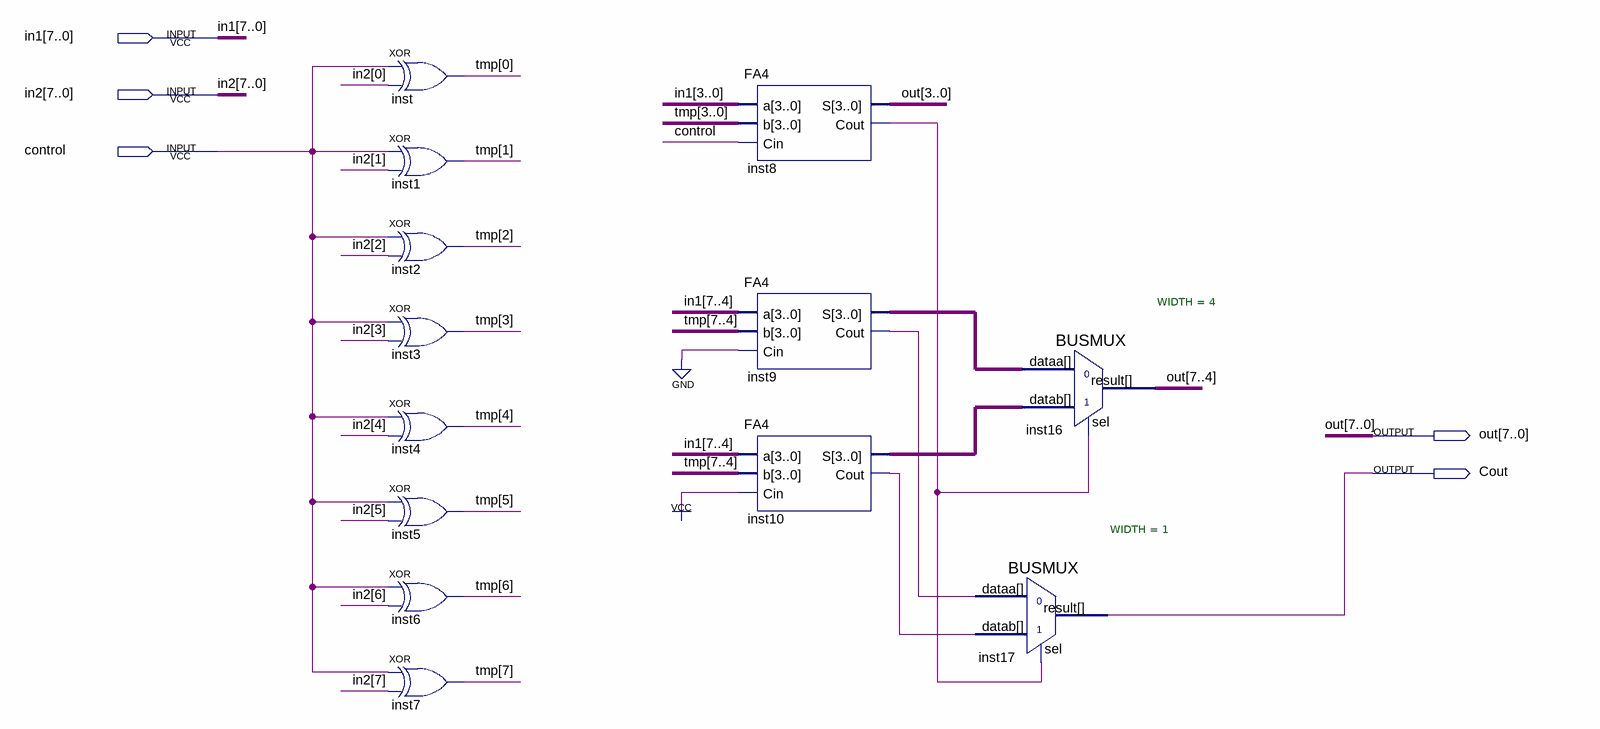
[diagram p0: schematic sheet]
// Quartus schematic ADDSUB8.bdf as structural Verilog: 13 symbols, 5 pins
module ADDSUB8 (
  input  [7:0] in1,
  input  [7:0] in2,
  input  control,
  output [7:0] out,
  output Cout
);

  wire inst8_cout, inst9_cout, inst10_cout;
  wire [3:0] inst9_s, inst10_s;
  wire [7:0] tmp;

  xor inst (tmp[0], control, in2[0]);
  xor inst1 (tmp[1], control, in2[1]);
  xor inst2 (tmp[2], control, in2[2]);
  xor inst3 (tmp[3], control, in2[3]);
  xor inst4 (tmp[4], control, in2[4]);
  xor inst5 (tmp[5], control, in2[5]);
  xor inst6 (tmp[6], control, in2[6]);
  xor inst7 (tmp[7], control, in2[7]);
  FA4 inst8 (.a(in1[3:0]), .b(tmp[3:0]), .Cin(control), .S(out[3:0]), .Cout(inst8_cout));
  FA4 inst9 (.a(in1[7:4]), .b(tmp[7:4]), .Cin(1'b0), .S(inst9_s), .Cout(inst9_cout));
  FA4 inst10 (.a(in1[7:4]), .b(tmp[7:4]), .Cin(1'b1), .S(inst10_s), .Cout(inst10_cout));
  BUSMUX #(.WIDTH(1)) inst17 (.datab(inst10_cout), .sel(inst8_cout), .dataa(inst9_cout), .result(Cout));
  BUSMUX #(.WIDTH(4)) inst16 (.datab(inst10_s), .sel(inst8_cout), .dataa(inst9_s), .result(out[7:4]));
endmodule
